# Altium project UV_Watch_1.PrjPcb (part 1 of 2)
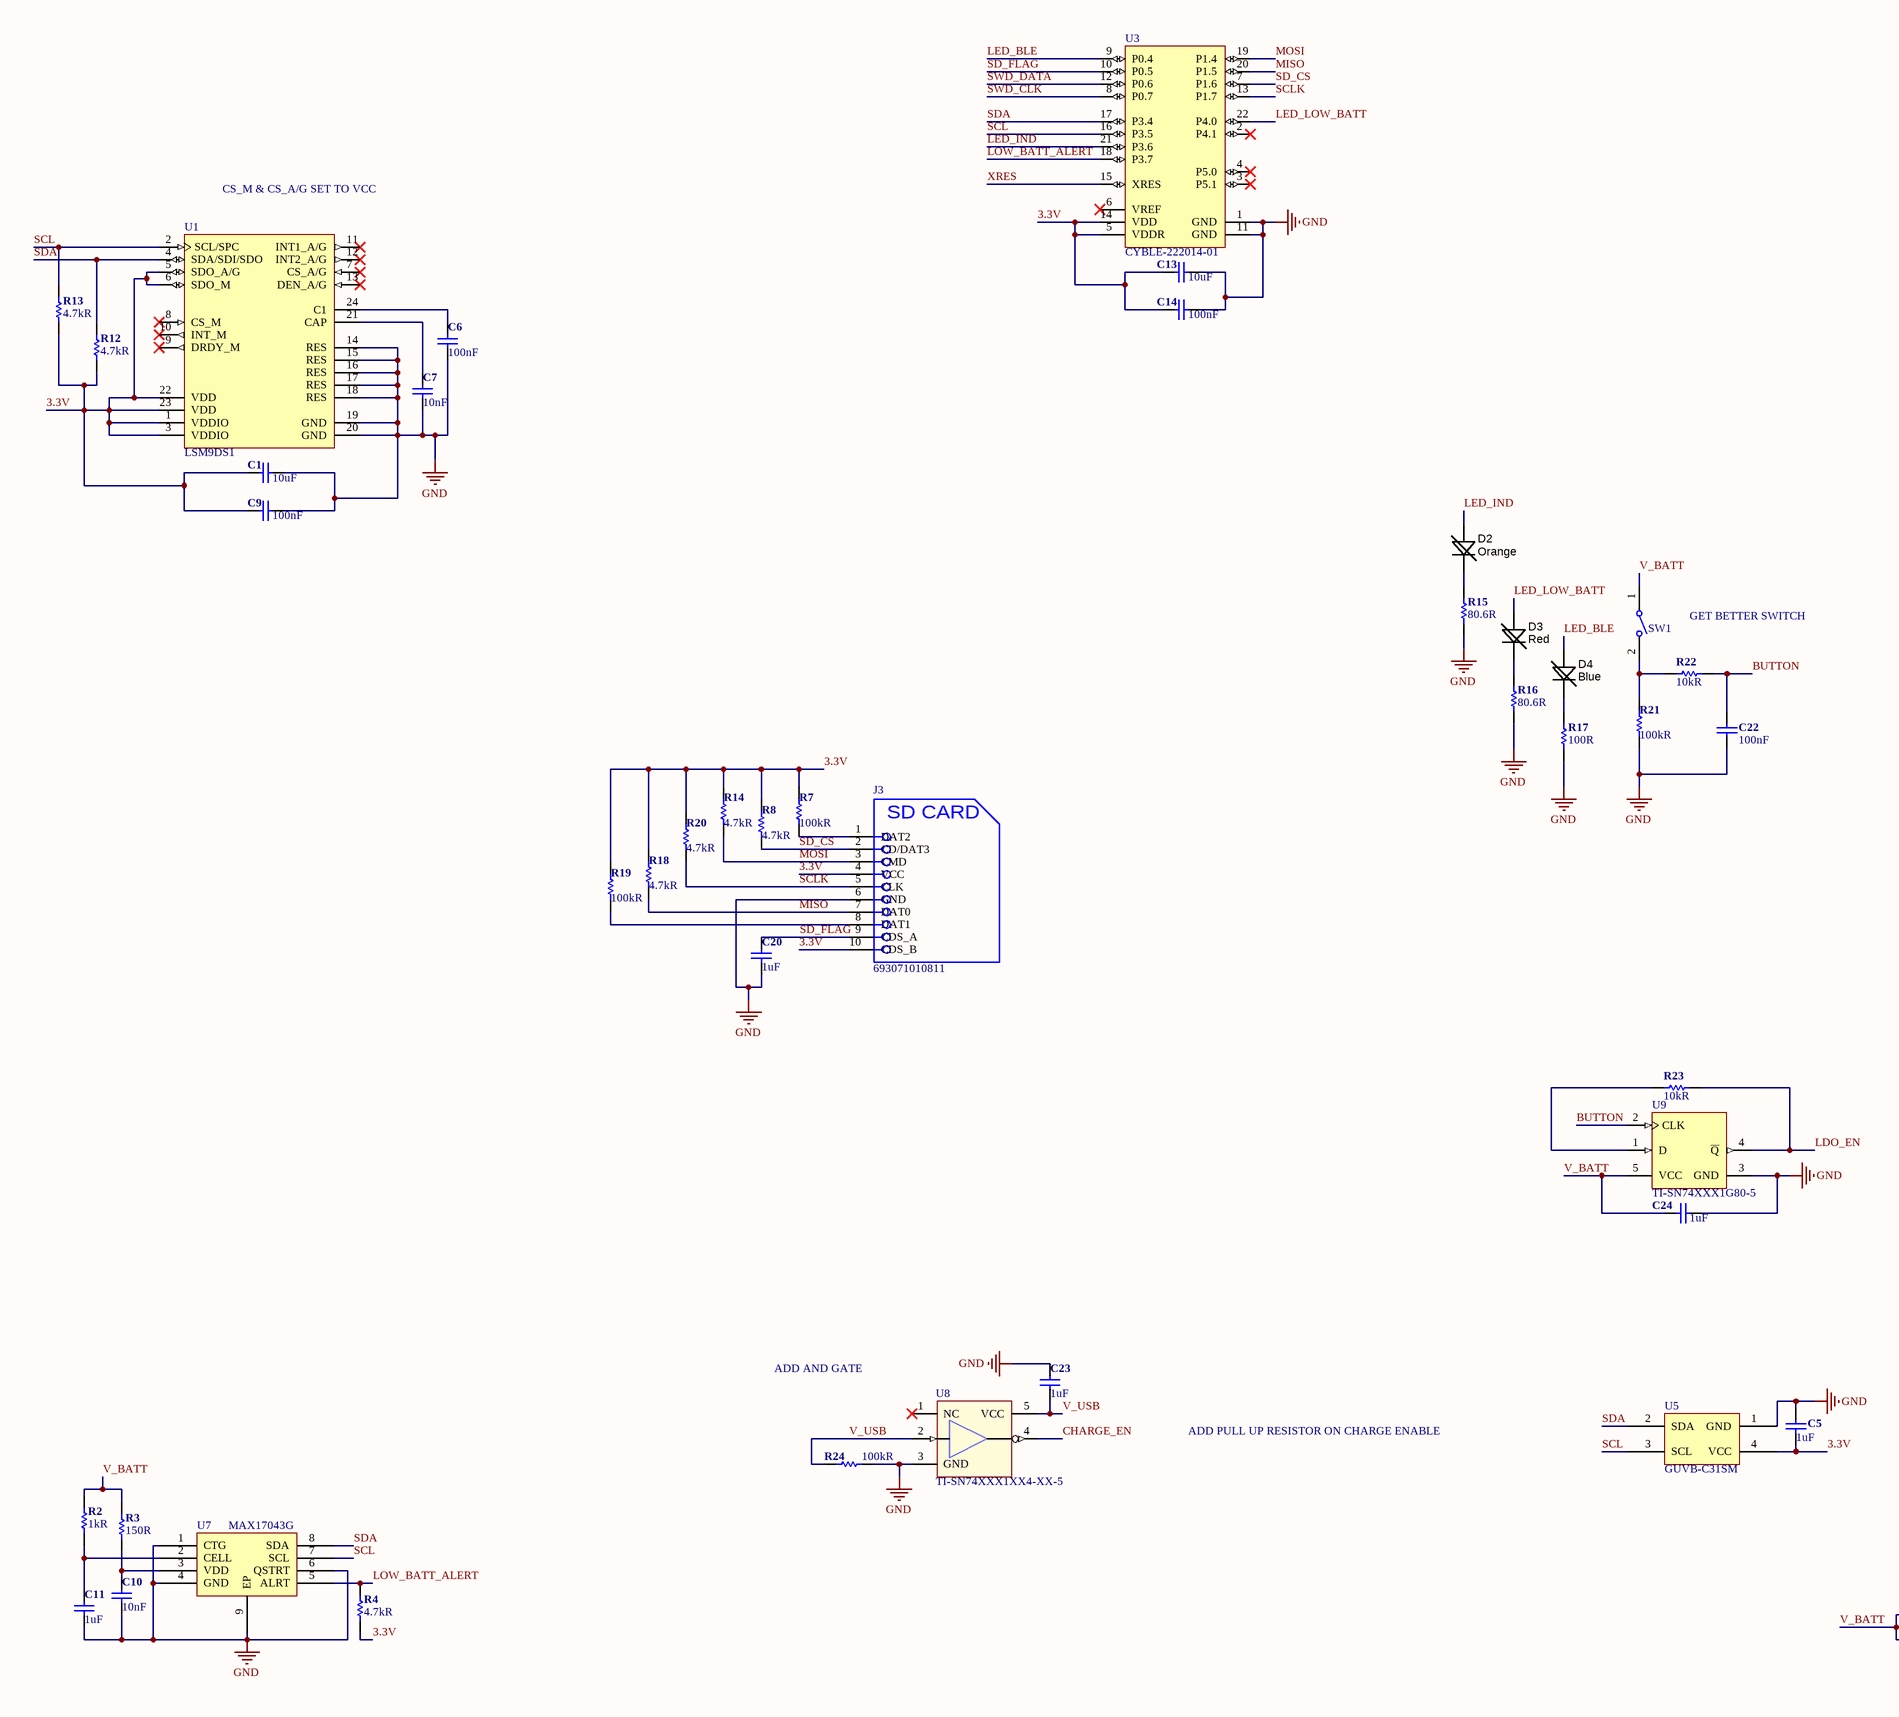
[diagram p0: UV_Watch_1.SchDoc, left]
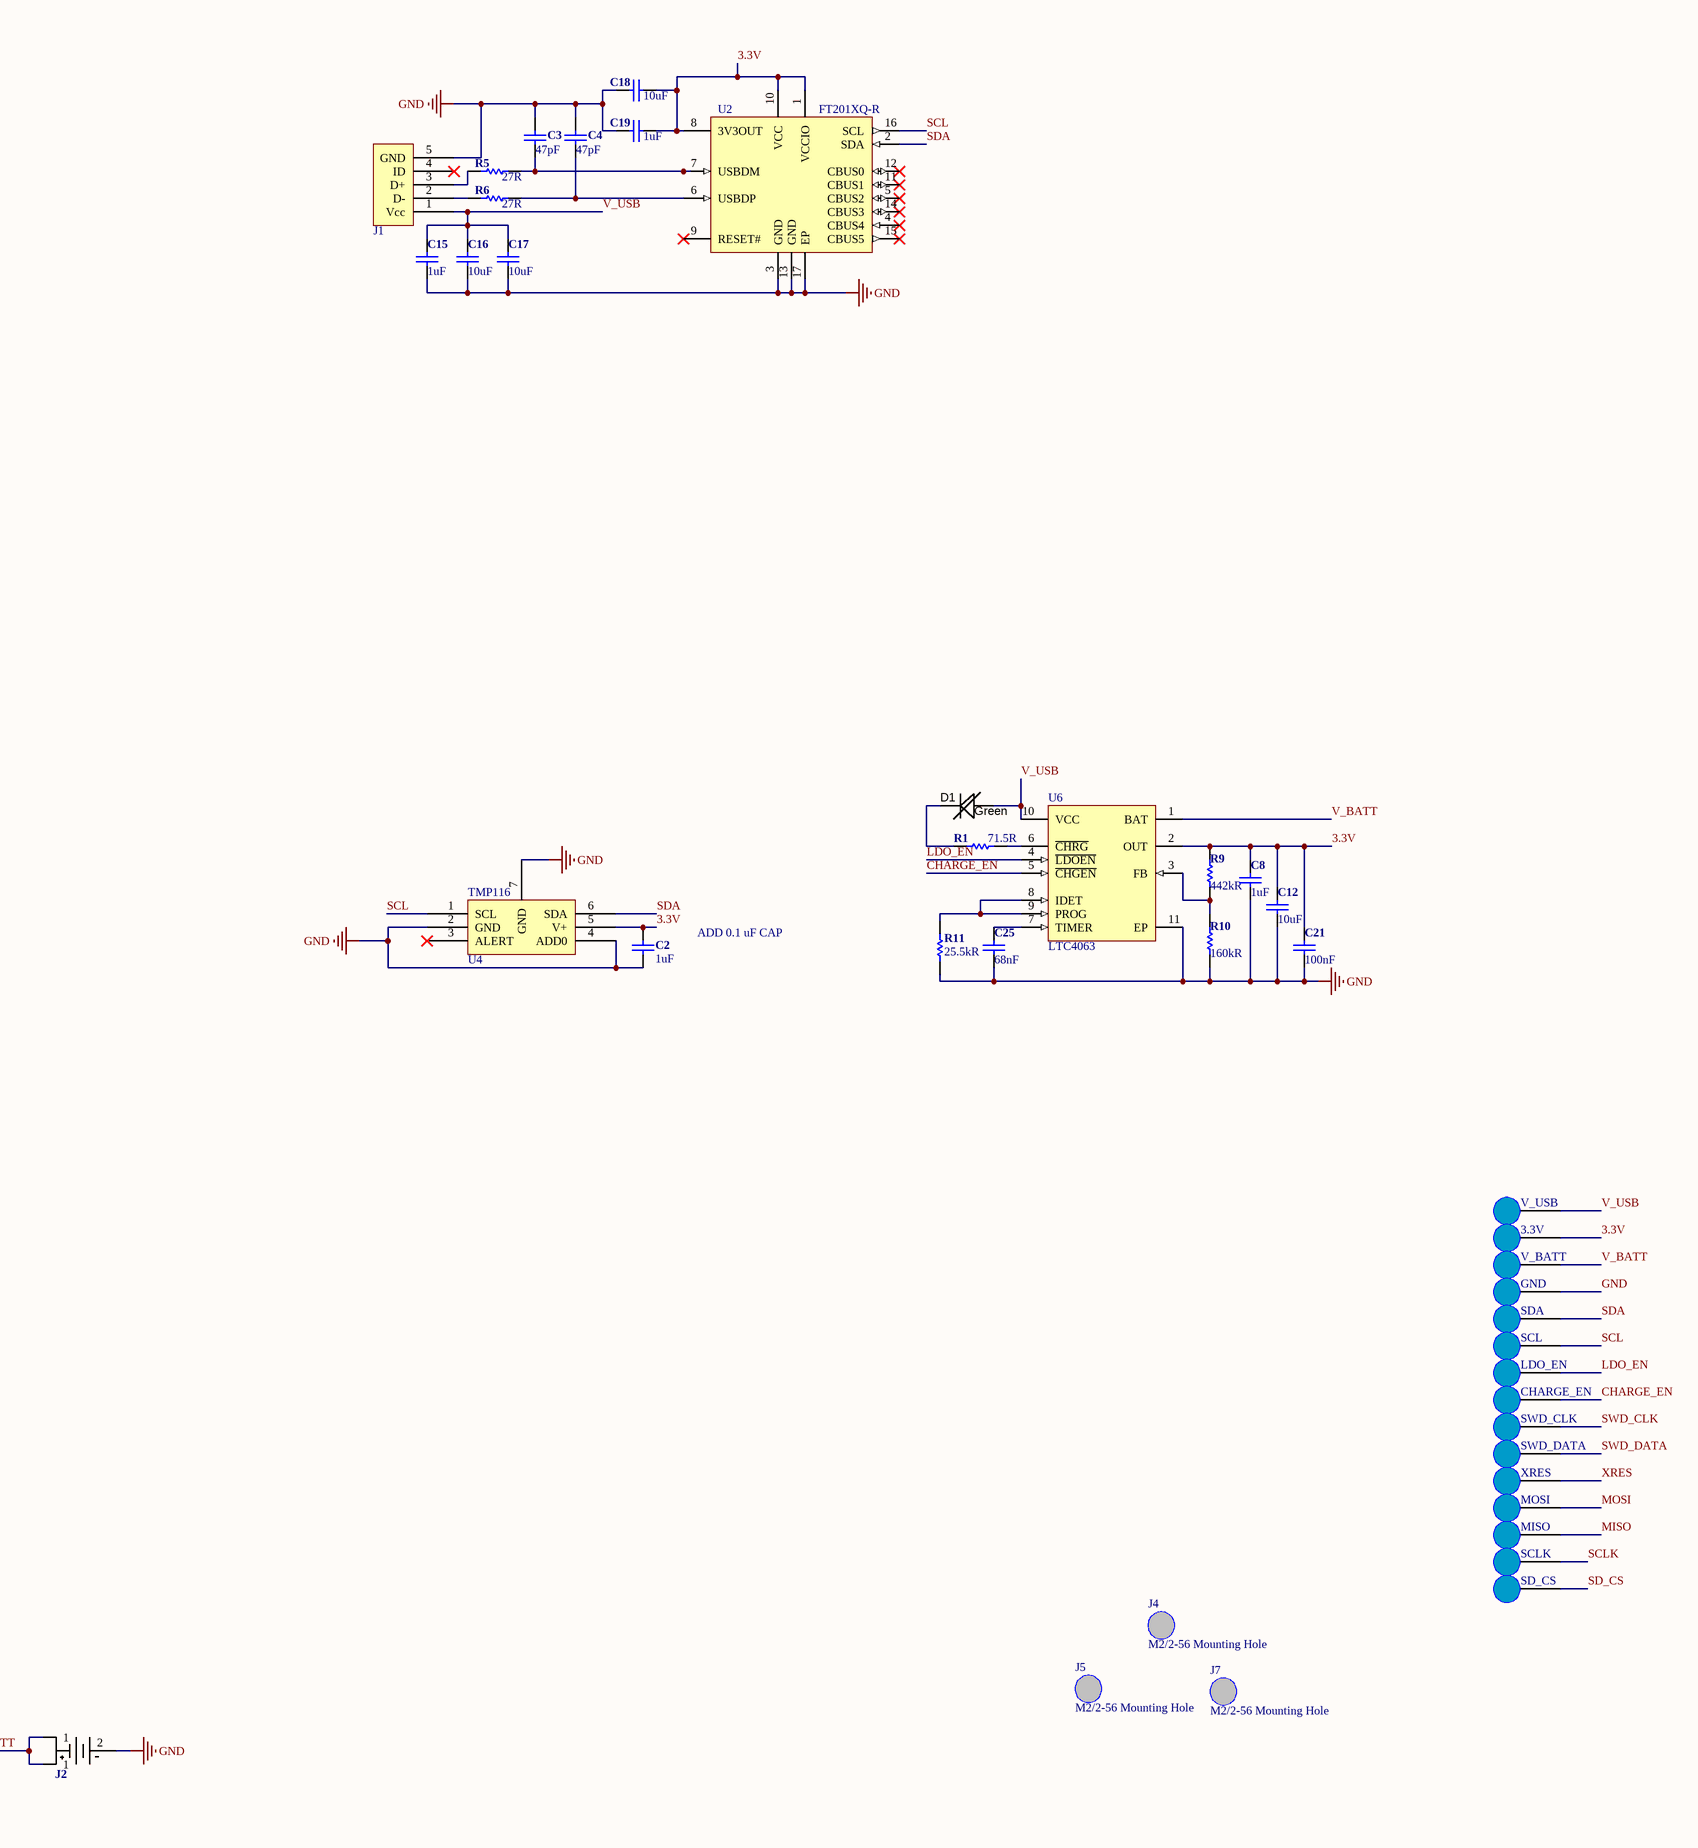
[diagram p1: UV_Watch_1.SchDoc, right]
1 sheet, 84 parts. Net scope: global (net labels, ports and power ports of the same name join across sheets).
Board file: UV_Watch_1.PcbDoc

## Sheet UV_Watch_1.SchDoc
size A1

### Parts
3.3V  Pogo-Pin Pad  [Pogo-Pin-Hole]  (value not drawn)
C1  10uF  [CAP-0805(2012)-R]
C2  1uF  [CAP-0805(2012)-R]
C3  47pF  [CAP-0805(2012)-R]
C4  47pF  [CAP-0805(2012)-R]
C5  1uF  [CAP-0805(2012)-R]
C6  100nF  [CAP-0805(2012)-R]
C7  10nF  [CAP-0805(2012)-R]
C8  1uF  [CAP-0805(2012)-R]
C9  100nF  [CAP-0805(2012)-R]
C10  10nF  [CAP-0805(2012)-R]
C11  1uF  [CAP-0805(2012)-R]
C12  10uF  [CAP-0805(2012)-R]
C13  10uF  [CAP-0805(2012)-R]
C14  100nF  [CAP-0805(2012)-R]
C15  1uF  [CAP-0805(2012)-R]
C16  10uF  [CAP-0805(2012)-R]
C17  10uF  [CAP-0805(2012)-R]
C18  10uF  [CAP-0805(2012)-R]
C19  1uF  [CAP-0805(2012)-R]
C20  1uF  [CAP-0805(2012)-R]
C21  100nF  [CAP-0805(2012)-R]
C22  100nF  [CAP-0805(2012)-R]
C23  1uF  [CAP-0805(2012)-R]
C24  1uF  [CAP-0805(2012)-R]
C25  68nF  [CAP-0805(2012)-R]
CHARGE_EN  Pogo-Pin Pad  [Pogo-Pin-Hole]  (value not drawn)
D1  Green  [LED-0805-A]
D2  Orange  [LED-0805-A]
D3  Red  [LED-0805-A]
D4  Blue  [LED-0805-A]
GND  Pogo-Pin Pad  [Pogo-Pin-Hole]  (value not drawn)
J1  USB  [USB_Connector_5P_MICRO_USB_FCI]  (value not drawn)
J2  Header 2 pin  [LINX_BATT_HLDR]  (value not drawn)
J3  693071010811  [693071010811]
J4  M2/2-56 Mounting Hole  [Mounting Hole]
J5  M2/2-56 Mounting Hole  [Mounting Hole]
J7  M2/2-56 Mounting Hole  [Mounting Hole]
LDO_EN  Pogo-Pin Pad  [Pogo-Pin-Hole]  (value not drawn)
MISO  Pogo-Pin Pad  [Pogo-Pin-Hole]  (value not drawn)
MOSI  Pogo-Pin Pad  [Pogo-Pin-Hole]  (value not drawn)
R1  71.5R  [R-0805(2012)-R]
R2  1kR  [R-0805(2012)-R]
R3  150R  [R-0805(2012)-R]
R4  4.7kR  [R-0805(2012)-R]
R5  27R  [R-0805(2012)-R]
R6  27R  [R-0805(2012)-R]
R7  100kR  [R-0805(2012)-R]
R8  4.7kR  [R-0805(2012)-R]
R9  442kR  [R-0805(2012)-R]
R10  160kR  [R-0805(2012)-R]
R11  25.5kR  [R-0805(2012)-R]
R12  4.7kR  [R-0805(2012)-R]
R13  4.7kR  [R-0805(2012)-R]
R14  4.7kR  [R-0805(2012)-R]
R15  80.6R  [R-0805(2012)-R]
R16  80.6R  [R-0805(2012)-R]
R17  100R  [R-0805(2012)-R]
R18  4.7kR  [R-0805(2012)-R]
R19  100kR  [R-0805(2012)-R]
R20  4.7kR  [R-0805(2012)-R]
R21  100kR  [R-0805(2012)-R]
R22  10kR  [R-0805(2012)-R]
R23  10kR  [R-0805(2012)-R]
R24  100kR  [R-0805(2012)-R]
SCL  Pogo-Pin Pad  [Pogo-Pin-Hole]  (value not drawn)
SCLK  Pogo-Pin Pad  [Pogo-Pin-Hole]  (value not drawn)
SD_CS  Pogo-Pin Pad  [Pogo-Pin-Hole]  (value not drawn)
SDA  Pogo-Pin Pad  [Pogo-Pin-Hole]  (value not drawn)
SW1  SW-SPST-2_C  [OMRON-B3U-3000P_V]  (value not drawn)
SWD_CLK  Pogo-Pin Pad  [Pogo-Pin-Hole]  (value not drawn)
SWD_DATA  Pogo-Pin Pad  [Pogo-Pin-Hole]  (value not drawn)
U1  LSM9DS1  [STM-LGA-24]
U2  FT201XQ-R  [QFN-16]
U3  CYBLE-222014-01  [CYP-SP21_V]
U4  TMP116  [WSON-6]
U5  GUVB-C31SM  [GUVB-C31SM]
U6  LTC4063  [LT-DD-10_V]
U7  MAX17043G  [TDFN-MN8]
U8  TI-SN74XXX1XX4-XX-5  [DBV0005A_M]
U9  TI-SN74XXX1G80-5  [DBV0005A_L]
V_BATT  Pogo-Pin Pad  [Pogo-Pin-Hole]  (value not drawn)
V_USB  Pogo-Pin Pad  [Pogo-Pin-Hole]  (value not drawn)
XRES  Pogo-Pin Pad  [Pogo-Pin-Hole]  (value not drawn)

### Nets
GND: C1.2 C2.2 C3.1 C4.1 C5.1 C6.2 C7.2 C8.2 C9.2 C10.2 C11.2 C12.2 C13.2 C14.2 C15.2 C16.1 C17.1 C18.2 C19.1 C20.2 C21.1 C22.1 C23.1 C24.2 C25.2 GND.1 J1.5(GND) J2.2 J3.6(GND) R10.2 R11.2 R15.1 R16.1 R17.1 R21.2 R24.2 U1.14(RES) U1.15(RES) U1.16(RES) U1.17(RES) U1.18(RES) U1.19(GND) U1.20(GND) U2.3(GND) U2.13(GND) U2.17(EP) U3.1(GND) U3.11(GND) U4.2(GND) U4.4(ADD0) U4.7(GND) U5.1(GND) U6.11(EP) U7.1(CTG) U7.4(GND) U7.6(QSTRT) U7.9(EP) U8.3(GND) U9.3(GND)
3.3V: 3.3V.1 C1.1 C2.1 C5.2 C8.1 C9.1 C12.1 C13.1 C14.1 C18.1 C19.2 C21.2 J3.4(VCC) J3.10(CDS_B) R4.1 R7.1 R8.1 R9.2 R12.2 R13.1 R14.1 R18.1 R19.1 R20.1 U1.1(VDDIO) U1.3(VDDIO) U1.5(SDO_A/G) U1.6(SDO_M) U1.22(VDD) U1.23(VDD) U2.1(VCCIO) U2.8(3V3OUT) U2.10(VCC) U3.5(VDDR) U3.14(VDD) U4.5(V+) U5.4(VCC) U6.2(OUT)
BUTTON: C22.2 R22.2 U9.2(CLK)
CHARGE_EN: CHARGE_EN.1 U6.5(~{CHGEN}) U8.4(Y)
LDO_EN: LDO_EN.1 R23.2 U6.4(~{LDOEN}) U9.4(~{Q})
LED_BLE: D4.A U3.9(P0.4)
LED_IND: D2.A U3.21(P3.6)
LED_LOW_BATT: D3.A U3.22(P4.0)
LOW_BATT_ALERT: R4.2 U3.18(P3.7) U7.5(ALRT)
MISO: J3.7(DAT0) MISO.1 R18.2 U3.20(P1.5)
MOSI: J3.3(CMD) MOSI.1 R14.2 U3.19(P1.4)
SCL: R13.2 SCL.1 U1.2(SCL/SPC) U2.16(SCL) U3.16(P3.5) U4.1(SCL) U5.3(SCL) U7.7(SCL)
SCLK: J3.5(CLK) R20.2 SCLK.1 U3.13(P1.7)
SD_CS: J3.2(CD/DAT3) R8.2 SD_CS.1 U3.7(P1.6)
SD_FLAG: C20.1 J3.9(CDS_A) U3.10(P0.5)
SDA: R12.1 SDA.1 U1.4(SDA/SDI/SDO) U2.2(SDA) U3.17(P3.4) U4.6(SDA) U5.2(SDA) U7.8(SDA)
SWD_CLK: SWD_CLK.1 U3.8(P0.7)
SWD_DATA: SWD_DATA.1 U3.12(P0.6)
V_BATT: C24.1 J2.1 R2.2 R3.2 SW1.1 U6.1(BAT) U9.5(VCC) V_BATT.1
V_USB: C15.1 C16.2 C17.2 C23.2 D1.A J1.1(Vcc) R24.1 U6.10(VCC) U8.2(A) U8.5(VCC) V_USB.1
XRES: U3.15(XRES) XRES.1
NetC3_2: C3.2 R5.2 U2.7(USBDM)
NetC4_2: C4.2 R6.2 U2.6(USBDP)
NetC6_1: C6.1 U1.24(C1)
NetC7_1: C7.1 U1.21(CAP)
NetC10_1: C10.1 R3.1 U7.3(VDD)
NetC11_1: C11.1 R2.1 U7.2(CELL)
NetC25_1: C25.1 U6.7(TIMER)
NetD1_K: D1.K R1.1
NetD2_K: D2.K R15.2
NetD3_K: D3.K R16.2
NetD4_K: D4.K R17.2
NetJ1_2: J1.2(D-) R6.1
NetJ1_3: J1.3(D+) R5.1
NetJ3_1: J3.1(DAT2) R7.2
NetJ3_8: J3.8(DAT1) R19.2
NetR1_2: R1.2 U6.6(~{CHRG})
NetR9_1: R9.1 R10.1 U6.3(FB)
NetR11_1: R11.1 U6.8(IDET) U6.9(PROG)
NetR21_1: R21.1 R22.1 SW1.2
NetR23_1: R23.1 U9.1(D)

Not connected (* = marked no-connect by the designer): J1 4(ID)*; U1 7(CS_A/G)* 8(CS_M)* 9(DRDY_M)* 10(INT_M)* 11(INT1_A/G)* 12(INT2_A/G)* 13(DEN_A/G)*; U2 4(CBUS4)* 5(CBUS2)* 9(RESET#)* 11(CBUS1)* 12(CBUS0)* 14(CBUS3)* 15(CBUS5)*; U3 2(P4.1)* 3(P5.1)* 4(P5.0)* 6(VREF)*; U4 3(ALERT)*; U8 1(NC)*

### Notes on the sheet
- CS_M & CS_A/G SET TO VCC
- GET BETTER SWITCH
- ADD 0.1 uF CAP
- ADD AND GATE
- ADD PULL UP RESISTOR ON CHARGE ENABLE
- Title
- Size:
- Date:
- File:
- A1
- Number:
- Time:
- Revision:
- Sheet
- of
- (in symbol 693071010811) SD CARD